# EAGLE schematic D-DAQ (EAGLE 6.4)
D-DAQ PIC32MX-controlled modular data aquisition and display
REVISION: 1
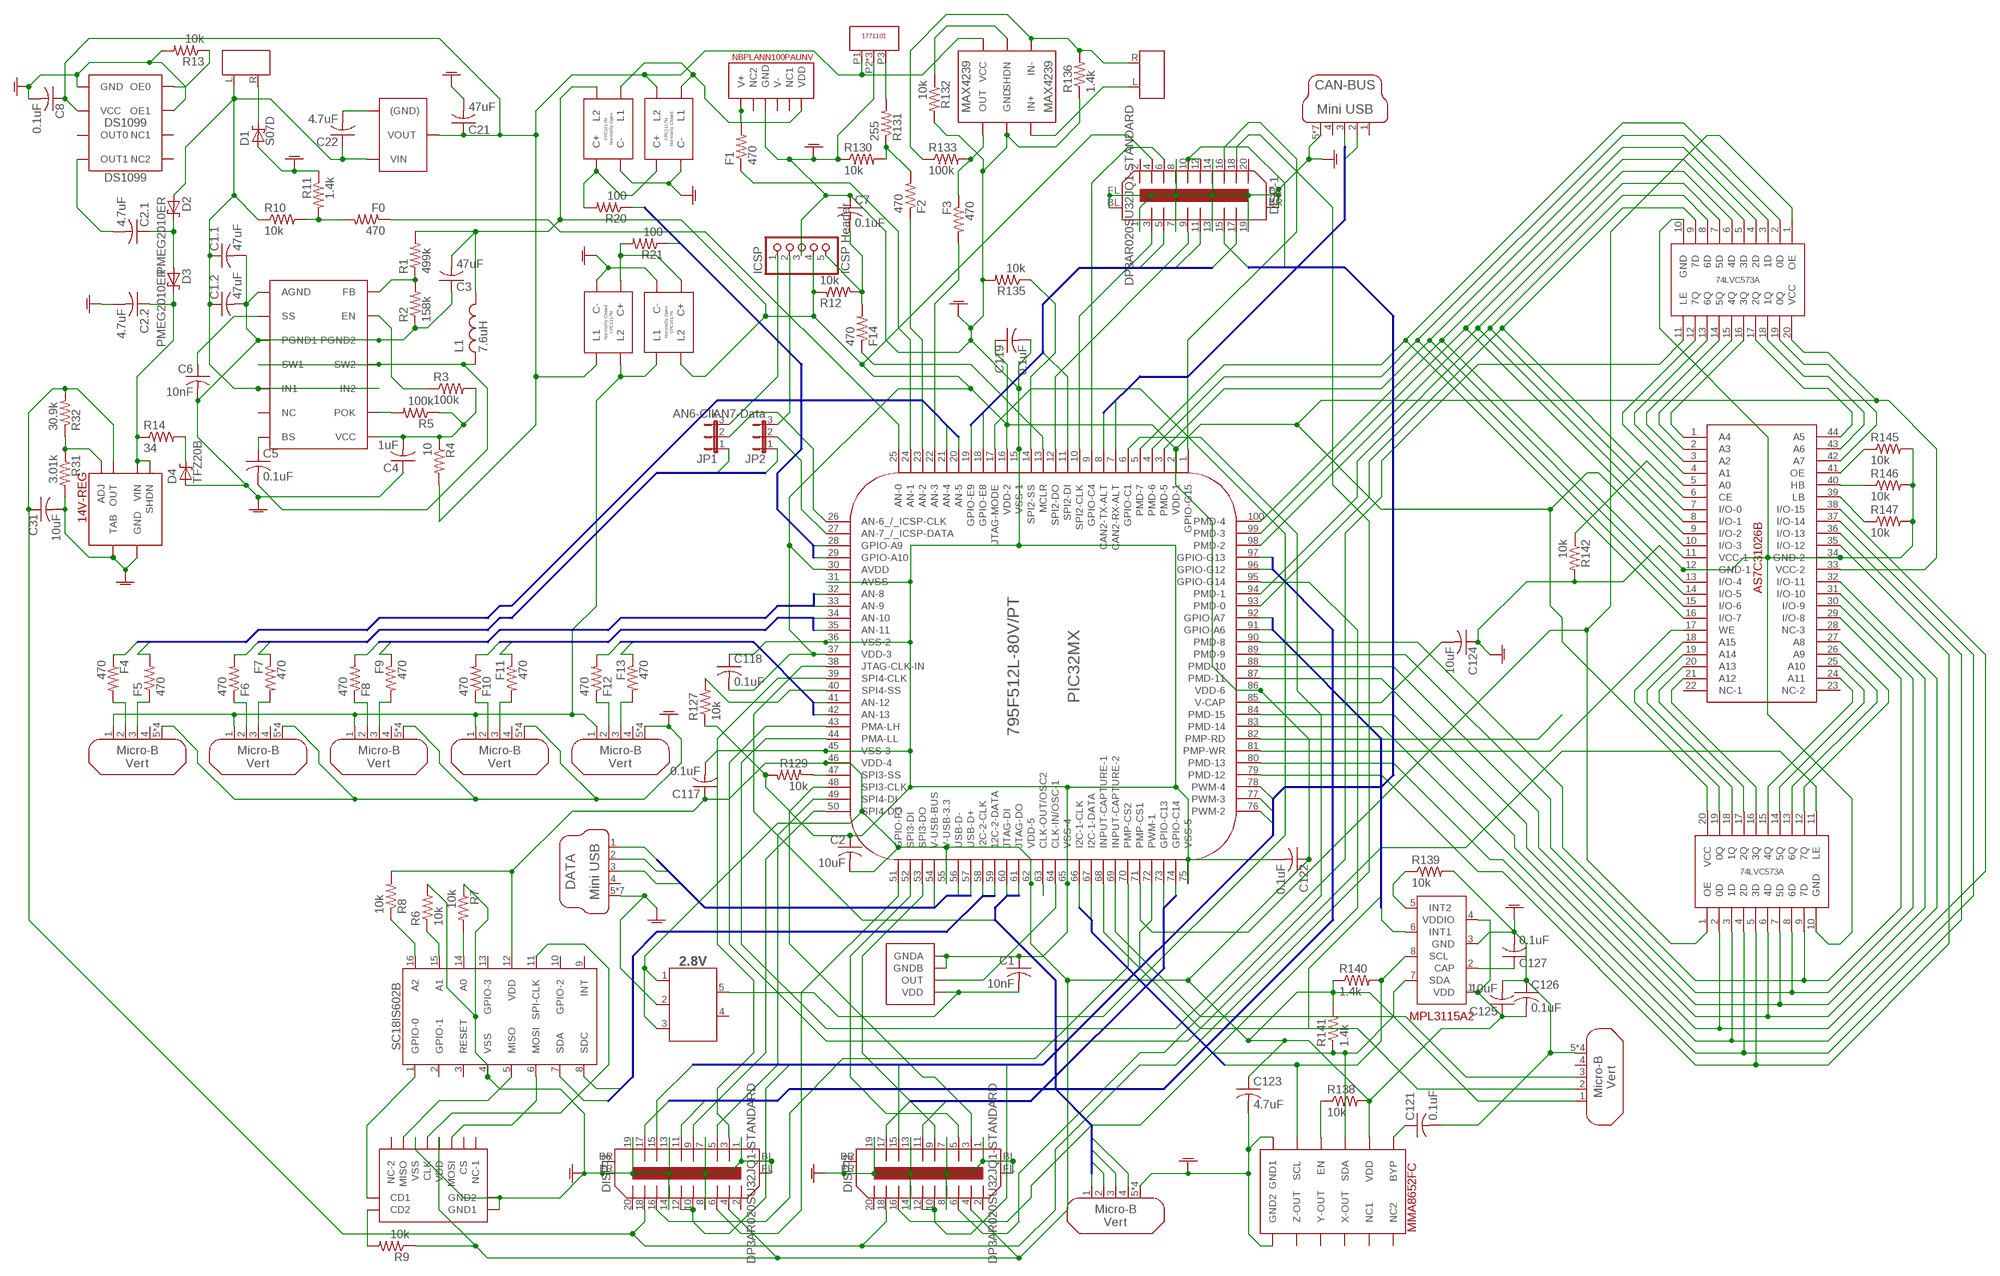
[diagram p0: schematic, sheet 1]

## Parts
2.8V  TC1016  [SOT-23-5]
3.3V-TOGGLE-1  NO SSR  CPC1017N  [SOP-4--CPC1017N]
3.3V-TOGGLE-2  NO SSR  CPC1017N  [SOP-4--CPC1017N]
4&5  Micro USB  105133-0001  [USB-MICRO-B-VERT]
5V-REG  ZLDO1117-5.0  ZLDO1117-ADJ  [SOT-223-5]
5V-TOGGLE-1  NC SSR  CPC1117N  [SOP-4--CPC1117N]
5V-TOGGLE-2  NC SSR  CPC1117N  [SOP-4--CPC1117N]
6&7  Micro USB  105133-0001  [USB-MICRO-B-VERT]
8&9  Micro USB  105133-0001  [USB-MICRO-B-VERT]
10&11  Micro USB  105133-0001  [USB-MICRO-B-VERT]
12&13  Micro USB  105133-0001  [USB-MICRO-B-VERT]
14V-REG  TL1963A-33DCQ  [SOT-223-6]
AS7C31026B  1 Mbit SRAM  AS7C31026B-12TC  [TSOP-44]
AUX-PRESS  PC-1771101  [PC-1771101]
C1  10nF  C-USC0603K  [C0603K]
C1.1  47uF  C-USC1206  [C1206]
C1.2  47uF  C-USC1206  [C1206]
C2  10uF  C-USC0603K  [C0603K]
C2.1  4.7uF  C-USC1206  [C1206]
C2.2  4.7uF  C-USC1206  [C1206]
C3  47uF  C-USC1206  [C1206]
C4  1uF  C-USC0603K  [C0603K]
C5  0.1uF  C-USC0603K  [C0603K]
C6  10nF  C-USC0603K  [C0603K]
C7  0.1uF  C-USC0603K  [C0603K]
C8  0.1uF  C-USC0603K  [C0603K]
C21  47uF  C-USC1206  [C1206]
C22  4.7uF  C-USC1206  [C1206]
C31  10uF  C-USC1206  [C1206]
C117  0.1uF  C-USC0603K  [C0603K]
C118  0.1uF  C-USC0603K  [C0603K]
C119  0.1uF  C-USC0603K  [C0603K]
C121  0.1uF  C-USC0603K  [C0603K]
C122  0.1uF  C-USC0603K  [C0603K]
C123  4.7uF  C-USC0603K  [C0603K]
C124  10uF  C-USC0603K  [C0603K]
C125  10uF  C-USC0603K  [C0603K]
C126  0.1uF  C-USC0603K  [C0603K]
C127  0.1uF  C-USC0603K  [C0603K]
CAN-BUS  Mini USB  UE25-BE55-10H  [USB-MINI-B-VERT]
D1  S07D  [SOD-123W]
D2  PMEG2010ER  S07D  [SOD-123W]
D3  PMEG2010ER  S07D  [SOD-123W]
D4  TFZ20B  TFZ-DIODE  [TUMD2]
DATA  Mini USB  UE25-BE55-10H  [USB-MINI-B-VERT]
DISP-1  DP3AR020SU32JQ1-STANDARD  [DP3AR020SU32JQ1-STANDARD]
DISP-2  DP3AR020SU32JQ1-STANDARD  [DP3AR020SU32JQ1-STANDARD]
DISP-3  DP3AR020SU32JQ1-STANDARD  [DP3AR020SU32JQ1-STANDARD]
EGT  1702610  [PC-1702610]
EGT-AMP  MAX4239  [SOT-8]
F0  470  R-US_R0603  [R0603]
F1  470  R-US_R0603  [R0603]
F2  470  R-US_R0603  [R0603]
F3  470  R-US_R0603  [R0603]
F4  470  R-US_R0603  [R0603]
F5  470  R-US_R0603  [R0603]
F6  470  R-US_R0603  [R0603]
F7  470  R-US_R0603  [R0603]
F8  470  R-US_R0603  [R0603]
F9  470  R-US_R0603  [R0603]
F10  470  R-US_R0603  [R0603]
F11  470  R-US_R0603  [R0603]
F12  470  R-US_R0603  [R0603]
F13  470  R-US_R0603  [R0603]
F14  470  R-US_R0603  [R0603]
ICSP  ICSP Header  PINHD-1X5  [1X05]
IMP.  Micro USB  105133-0001  [USB-MICRO-B-VERT]
JP1  AN6-Clk  JP2E  [JP2]
JP2  AN7-Data  JP2E  [JP2]
JTAG  Micro USB  105133-0001  [USB-MICRO-B-VERT]
L1  7.6uH  WE-INDUCTOR  [7443551XXX]
LATCH-HIGH  Octal D-Latch  74LVC573A  [TSSOP-20]
LATCH-LOW  Octal D-Latch  74LVC573A  [TSSOP-20]
MAIN-SMPS  MP2209  [QFN-14]
MICRO-SD  SCHA4B0400  MICRO-SD-SLOT  [SCHA4B0400]
MMA8652FC  Accelerometer  MMA8491Q  [QFN-12]
MPL3115A101  Baro & Temp  MPL3115A2  [LGA-8]
NBPLANN100PAUNV  Boost  NBP-SENSORS  [LEADLESS-SMT]
PIC32MX  795F512L-80V/PT  PIC32MX795F512L-80I/PT  [TQFP-100]
POWER  1702610  [PC-1702610]
R1  499k  R-US_R0603  [R0603]
R2  158k  R-US_R0603  [R0603]
R3  100k  R-US_R0603  [R0603]
R4  10  R-US_R0603  [R0603]
R5  100k  R-US_R0603  [R0603]
R6  10k  R-US_R0603  [R0603]
R7  10k  R-US_R0603  [R0603]
R8  10k  R-US_R0603  [R0603]
R9  10k  R-US_R0603  [R0603]
R10  10k  R-US_R0603  [R0603]
R11  1.4k  R-US_R0603  [R0603]
R12  10k  R-US_R0603  [R0603]
R13  10k  R-US_R0603  [R0603]
R14  34  R-US_R0603  [R0603]
R20  100  R-US_R0603  [R0603]
R21  100  R-US_R0603  [R0603]
R31  3.01k  R-US_R0603  [R0603]
R32  30.9k  R-US_R0603  [R0603]
R127  10k  R-US_R0603  [R0603]
R129  10k  R-US_R0603  [R0603]
R130  10k  R-US_R0603  [R0603]
R131  255  R-US_R0603  [R0603]
R132  10k  R-US_R0603  [R0603]
R133  100k  R-US_R0603  [R0603]
R135  10k  R-US_R0603  [R0603]
R136  1.4k  R-US_R0603  [R0603]
R138  10k  R-US_R0603  [R0603]
R139  10k  R-US_R0603  [R0603]
R140  1.4k  R-US_R0603  [R0603]
R141  1.4k  R-US_R0603  [R0603]
R142  10k  R-US_R0603  [R0603]
R145  10k  R-US_R0603  [R0603]
R146  10k  R-US_R0603  [R0603]
R147  10k  R-US_R0603  [R0603]
SC18IS602B  I2C to SPI  SC18IS602B  [TSSOP-16]
Y1  16.368 MHz  XTC7009  [XTC7009]
Y2  DS1099  [SOIC-8]

## Nets
3.3-&-5V-TOGGLE1: PIC32MX.28(GPIO-A9) R21.1
3.3-&-5V-TOGGLE2: PIC32MX.29(GPIO-A10) R20.1
3.3V-RAIL: 2.8V.1(V-IN) 2.8V.3(SHDN) 3.3V-TOGGLE-1.4(L2) 3.3V-TOGGLE-2.4(L2) AS7C31026B.11(VCC-1) AS7C31026B.33(VCC-2) C2.2 C3.2 C117.1 C118.2 C119.1 C122.1 C123.1 C125.1 C126.2 DISP-1.4 DISP-2.4 DISP-3.4 ICSP.4 IMP..1 L1.P$2 LATCH-HIGH.20(VCC) LATCH-LOW.20(VCC) MICRO-SD.4(VDD) MMA8652FC.2(VDD) MPL3115A101.1(VDD) MPL3115A101.4(VDDIO) PIC32MX.2(VDD-1) PIC32MX.16(VDD-2) PIC32MX.30(AVDD) PIC32MX.37(VDD-3) PIC32MX.46(VDD-4) PIC32MX.55(V-USB-3.3) PIC32MX.62(VDD-5) PIC32MX.86(VDD-6) R1.2 R8.2 R9.1 R12.1 R138.2 R140.1 R141.2 SC18IS602B.12(VDD)
5V-ADJ: 5V-REG.ADJ((GND)) C22.2
5V-RAIL: 5V-REG.VOUT 5V-REG.VOUT-1(VOUT) 5V-TOGGLE-1.3(L1) 5V-TOGGLE-2.4(L2) AUX-PRESS.P1 C8.1 C21.1 EGT-AMP.6(VCC) R4.2 Y2.3(VCC)
12V-BS: C5.1 MAIN-SMPS.7(BS)
12V-ENABLE: MAIN-SMPS.13(EN) R3.1
12V-FB: MAIN-SMPS.P14(FB) R1.1 R2.2
12V-INPUT: 5V-REG.VIN C1.1.1 C1.2.1 C22.1 D2.P$2 MAIN-SMPS.5(IN1) MAIN-SMPS.10(IN2) POWER.L R10.1
12V-OK: MAIN-SMPS.9(POK) R5.2
12V-SS: C6.1 MAIN-SMPS.2(SS)
12V-SW: C5.2 L1.P$1 MAIN-SMPS.4(SW1) MAIN-SMPS.11(SW2)
12V-VCC: C4.2 MAIN-SMPS.8(VCC) R3.2 R4.1 R5.1
14V-12V-DIVIDER: F0.2 R10.2 R11.2
14V-ADJ: 14V-REG.ADJ R31.1 R32.1
14V-INPUT: 14V-REG.SHDN 14V-REG.VIN C2.2.1 D3.P$1 R14.1
14V-RAIL: 14V-REG.VOUT(OUT) C31.1 DISP-1.18 DISP-2.18 DISP-3.18 R32.2
100-PSI-SENSOR-RES: 3.3V-TOGGLE-2.1(C+) 5V-TOGGLE-2.1(C+) R20.2
A0-PD: R7.2 SC18IS602B.14(A0)
A1-PD: R6.1 SC18IS602B.15(A1)
A2-PU: R8.1 SC18IS602B.16(A2)
ACCEL-EN: MMA8652FC.4(EN) R138.1
ADD-0: AS7C31026B.5(A0) LATCH-LOW.12(7Q)
ADD-1: AS7C31026B.4(A1) LATCH-LOW.13(6Q)
ADD-2: AS7C31026B.3(A2) LATCH-LOW.14(5Q)
ADD-3: AS7C31026B.2(A3) LATCH-LOW.15(4Q)
ADD-4: AS7C31026B.1(A4) LATCH-LOW.16(3Q)
ADD-5: AS7C31026B.44(A5) LATCH-LOW.17(2Q)
ADD-6: AS7C31026B.43(A6) LATCH-LOW.18(1Q)
ADD-7: AS7C31026B.42(A7) LATCH-LOW.19(0Q)
ADD-8: AS7C31026B.27(A8) LATCH-HIGH.12(7Q)
ADD-9: AS7C31026B.26(A9) LATCH-HIGH.13(6Q)
ADD-10: AS7C31026B.25(A10) LATCH-HIGH.14(5Q)
ADD-11: AS7C31026B.24(A11) LATCH-HIGH.15(4Q)
ADD-12: AS7C31026B.21(A12) LATCH-HIGH.16(3Q)
ADD-13: AS7C31026B.20(A13) LATCH-HIGH.17(2Q)
ADD-14: AS7C31026B.19(A14) LATCH-HIGH.18(1Q)
ADD-15: AS7C31026B.18(A15) LATCH-HIGH.19(0Q)
AN0-VOLT: F0.1 PIC32MX.25(AN-0)
AN1-BOOST: F1.1 PIC32MX.24(AN-1)
AN2-OIL-PESS: F2.1 PIC32MX.23(AN-2)
AN3-EGT: F3.2 PIC32MX.22(AN-3)
AN4: 4&5.2 F4.2
AN5: 4&5.3 F5.1
AN6: 6&7.2 F6.1
AN7: 6&7.3 F7.2
AN8: 8&9.2 F8.1
AN9: 8&9.3 F9.2
AN10: 10&11.2 F10.1
AN11: 10&11.3 F11.2
AN12: 12&13.2 F12.1
AN13: 12&13.3 F13.2
AUTO-DETECT: 3.3V-TOGGLE-1.1(C+) 5V-TOGGLE-1.1(C+) R21.2
AUX-OUT: F2.2 R130.2 R131.1
BARO-INT2: MPL3115A101.5(INT2) R139.1
BOOST-OUT: F1.2 NBPLANN100PAUNV.6(V+)
BOOST-PWR: 3.3V-TOGGLE-2.3(L1) 5V-TOGGLE-2.3(L1) NBPLANN100PAUNV.1(VDD)
CAN-BUS1: CAN-BUS.2 PIC32MX.8(CAN2-TX-ALT)
CAN-BUS2: CAN-BUS.3 PIC32MX.7(CAN2-RX-ALT)
CARD-DETECT: MICRO-SD.G3(CD1) SC18IS602B.1(GPIO-0)
CE: AS7C31026B.6(CE) R142.1
CHARG-CAPS: C2.1.2 Y2.1(OUT1)
CP-PUMP: C2.1.1 D2.P$1 D3.P$2
CPS-INPUT: IMP..2 PIC32MX.68(INPUT-CAPTURE-1)
CRYSTAL-OUT: PIC32MX.63(CLK-OUT/OSC2)
DISP1-B1: DISP-1.5 PIC32MX.11(SPI2-DI)
DISP1-B2: DISP-1.11 PIC32MX.18(GPIO-E8)
DISP1-B3: DISP-1.17 PIC32MX.19(GPIO-E9)
DISP2-B1: DISP-2.5 PIC32MX.52(SPI3-DI)
DISP2-B2: DISP-2.11 PIC32MX.73(GPIO-C13)
DISP2-B3: DISP-2.17 PIC32MX.74(GPIO-C14)
DISP2-RS: DISP-2.16 PIC32MX.95(GPIO-G14)
DISP3-B1: DISP-3.5 PIC32MX.49(SPI4-DI)
DISP3-B2: DISP-3.11 PIC32MX.96(GPIO-G12)
DISP3-B3: DISP-3.17 PIC32MX.97(GPIO-G13)
DISP3-RS: DISP-1.16 PIC32MX.1(GPIO-G15)
DISP-1_HPD: DISP-1.6 PIC32MX.9(GPIO-C4)
DISP-HPD2: DISP-2.6 PIC32MX.6(GPIO-C1)
DISP-HPD3: DISP-3.6 PIC32MX.51(GPIO-F3)
EGT-NEG-IN: EGT-AMP.4(IN-) EGT.R R133.1 R136.2
EGT-OUT: EGT-AMP.1(OUT) F3.1 R133.2
EGT-POS-IN: EGT-AMP.3(IN+) EGT.L
EGT-SHTDWN: EGT-AMP.5(SHDN) R132.1
GND: 2.8V.2(GND) 3.3V-TOGGLE-1.2(C-) 3.3V-TOGGLE-2.2(C-) 4&5.5 4&5.T0 4&5.T1 4&5.T2 5V-TOGGLE-1.2(C-) 5V-TOGGLE-2.2(C-) 6&7.5 6&7.T0 6&7.T1 6&7.T2 8&9.5 8&9.T0 8&9.T1 8&9.T2 10&11.5 10&11.T0 10&11.T1 10&11.T2 12&13.5 12&13.T0 12&13.T1 12&13.T2 14V-REG.GND 14V-REG.TAB AS7C31026B.12(GND-1) AS7C31026B.34(GND-2) AUX-PRESS.P2 AUX-PRESS.T0 AUX-PRESS.T1 C1.1 C1.1.2 C1.2.2 C2.1 C2.2.2 C3.1 C4.1 C6.2 C7.1 C8.2 C21.2 C31.2 C117.2 C118.1 C119.2 C121.2 C122.2 C123.2 C124.1 C125.2 C126.1 C127.2 CAN-BUS.5 CAN-BUS.P$1 CAN-BUS.P$2 CAN-BUS.P$3 CAN-BUS.P$4 CAN-BUS.T0 CAN-BUS.T1 D1.P$2 D4.P$1(A) DATA.5 DATA.P$1 DATA.P$2 DATA.P$3 DATA.P$4 DATA.T0 DATA.T1 DISP-1.1 DISP-1.7 DISP-1.8 DISP-1.13 DISP-1.14 DISP-1.19 DISP-1.BL DISP-1.BR DISP-1.FL DISP-1.FR DISP-2.1 DISP-2.7 DISP-2.8 DISP-2.13 DISP-2.14 DISP-2.19 DISP-2.BL DISP-2.BR DISP-2.FL DISP-2.FR DISP-3.1 DISP-3.7 DISP-3.8 DISP-3.13 DISP-3.14 DISP-3.19 DISP-3.BL DISP-3.BR DISP-3.FL DISP-3.FR EGT-AMP.2(GND) ICSP.3 IMP..5 IMP..T0 IMP..T1 IMP..T2 JTAG.5 JTAG.T0 JTAG.T1 JTAG.T2 LATCH-HIGH.10(GND) LATCH-LOW.10(GND) MAIN-SMPS.1(AGND) MAIN-SMPS.3(PGND1) MAIN-SMPS.12(PGND2) MAIN-SMPS.P$15(AGND) MICRO-SD.6(VSS) MICRO-SD.G1(GND1) MICRO-SD.G2(GND2) MMA8652FC.6(GND1) MMA8652FC.7(GND2) MPL3115A101.3(GND) NBPLANN100PAUNV.4(GND) PIC32MX.15(VSS-1) PIC32MX.31(AVSS) PIC32MX.36(VSS-2) PIC32MX.45(VSS-3) PIC32MX.65(VSS-4) PIC32MX.75(VSS-5) R2.1 R6.2 R7.1 R11.1 R13.2 R31.2 R127.1 R129.2 R130.1 R132.2 R135.2 R136.1 R139.2 R142.2 R145.2 R146.2 R147.2 SC18IS602B.4(VSS) Y1.P$1(GNDA) Y1.P$2(GNDB) Y2.4(GND) Y2.6(OE1)
HB: AS7C31026B.40(HB) R146.1
I2C-INT-BUS-PIN1: MPL3115A101.6(INT1) PIC32MX.91(GPIO-A6)
I2C-INT-BUS-PIN2: PIC32MX.92(GPIO-A7)
I2C-PIN1: MMA8652FC.5(SCL) MPL3115A101.8(SCL) PIC32MX.66(I2C-1-CLK) R140.2
I2C-PIN2: MMA8652FC.3(SDA) MPL3115A101.7(SDA) PIC32MX.67(I2C-1-DATA) R141.1
I2C-SD-PIN1: PIC32MX.58(I2C-2-CLK) SC18IS602B.8(SDC)
I2C-SD-PIN2: PIC32MX.59(12C-2-DATA) SC18IS602B.7(SDA)
ICSP-CLK: ICSP.1 JP1.3
ICSP-DATA: ICSP.2 JP2.3
ICSP-MCLR: C7.2 F14.2 ICSP.5 R12.2
INPUT-6_/_ICSP-CLK: JP1.2 PIC32MX.26(AN-6_/_ICSP-CLK)
INPUT-7_/_ICSP-DATA: JP2.2 PIC32MX.27(AN-7_/_ICSP-DATA)
JTAG-PIN-1: JTAG.1 PIC32MX.17(JTAG-MODE)
JTAG-PIN-2: JTAG.2 PIC32MX.38(JTAG-CLK-IN)
JTAG-PIN-3: JTAG.3 PIC32MX.60(JTAG-DI)
JTAG-PIN-4: JTAG.4 PIC32MX.61(JTAG-DO)
LB: AS7C31026B.39(LB) R147.1
LNS-INPUT: IMP..3 PIC32MX.69(INPUT-CAPTURE-2)
MCLR: F14.1 PIC32MX.13(MCLR)
MPL-BYP-CAP: C127.1 MPL3115A101.2(CAP)
N$5: C121.1 MMA8652FC.1(BYP)
OE: AS7C31026B.41(OE) R145.1
OE0: R13.1 Y2.5(OE0)
OIL-PRESS-OUT: AUX-PRESS.P3 R131.2
OSC-PWR: 2.8V.5(V-OUT) C1.2 Y1.P$4(VDD)
OSC-SIG: PIC32MX.64(CLK-IN/OSC-1) Y1.P$3(OUT)
PMA-CS2: DISP-3.16 PIC32MX.70(PMP-CS2)
PMA-HL: LATCH-HIGH.11(LE) PIC32MX.43(PMA-LH)
PMA-LL: LATCH-LOW.11(LE) PIC32MX.44(PMA-LL)
PMD0: AS7C31026B.7(I/O-0) LATCH-LOW.9(7D) PIC32MX.93(PMD-0)
PMD1: AS7C31026B.8(I/O-1) LATCH-LOW.8(6D) PIC32MX.94(PMD-1)
PMD2: AS7C31026B.9(I/O-2) LATCH-LOW.7(5D) PIC32MX.98(PMD-2)
PMD3: AS7C31026B.10(I/O-3) LATCH-LOW.6(4D) PIC32MX.99(PMD-3)
PMD4: AS7C31026B.13(I/O-4) LATCH-LOW.5(3D) PIC32MX.100(PMD-4)
PMD5: AS7C31026B.14(I/O-5) LATCH-LOW.4(2D) PIC32MX.3(PMD-5)
PMD6: AS7C31026B.15(I/O-6) LATCH-LOW.3(1D) PIC32MX.4(PMD-6)
PMD7: AS7C31026B.16(I/O-7) LATCH-LOW.2(0D) PIC32MX.5(PMD-7)
PMD8: AS7C31026B.29(I/O-8) LATCH-HIGH.9(7D) PIC32MX.90(PMD-8)
PMD9: AS7C31026B.30(I/O-9) LATCH-HIGH.8(6D) PIC32MX.89(PMD-9)
PMD10: AS7C31026B.31(I/O-10) LATCH-HIGH.7(5D) PIC32MX.88(PMD-10)
PMD11: AS7C31026B.32(I/O-11) LATCH-HIGH.6(4D) PIC32MX.87(PMD-11)
PMD12: AS7C31026B.35(I/O-12) LATCH-HIGH.5(3D) PIC32MX.79(PMD-12)
PMD13: AS7C31026B.36(I/O-13) LATCH-HIGH.4(2D) PIC32MX.80(PMD-13)
PMD15: AS7C31026B.38(I/O-15) LATCH-HIGH.2(0D) PIC32MX.84(PMD-15)
PMD-14: AS7C31026B.37(I/O-14) LATCH-HIGH.3(1D) PIC32MX.83(PMD-14)
PMD-READ: PIC32MX.82(PMP-RD)
PMP-CS1: LATCH-HIGH.1(OE) LATCH-LOW.1(OE) PIC32MX.71(PMP-CS1)
PMP-WRITE: AS7C31026B.17(WE) PIC32MX.81(PMP-WR)
PWM1: DISP-3.15 PIC32MX.72(PWM-1)
PWM2: DISP-2.15 PIC32MX.76(PWM-2)
PWM3: DISP-1.15 PIC32MX.77(PWM-3)
PWM4: DISP-1.10 DISP-1.12 DISP-2.10 DISP-2.12 DISP-3.10 DISP-3.12 PIC32MX.78(PWM-4)
PWR-GND: D1.P$1 POWER.R
SD-MISO: MICRO-SD.7(MISO) SC18IS602B.5(MISO)
SD-MOSI: MICRO-SD.3(MOSI) SC18IS602B.6(MOSI)
SD-PULL-DOWN: MICRO-SD.G4(CD2) R9.2
SD-SPI-CLK: MICRO-SD.5(CLK) SC18IS602B.11(SPI-CLK)
SENSOR_PAIR_AN4: F4.1 PIC32MX.21(AN-4)
SENSOR_PAIR_AN5: F5.2 PIC32MX.20(AN-5)
SENSOR_PAIR_AN6: F6.2 JP1.1
SENSOR_PAIR_AN7: F7.1 JP2.1
SENSOR_PAIR_AN8: F8.2 PIC32MX.32(AN-8)
SENSOR_PAIR_AN9: F9.1 PIC32MX.33(AN-9)
SENSOR_PAIR_AN10: F10.2 PIC32MX.34(AN-10)
SENSOR_PAIR_AN11: F11.1 PIC32MX.35(AN-11)
SENSOR_PAIR_AN12: F12.2 PIC32MX.41(AN-12)
SENSOR_PAIR_AN13: F13.1 PIC32MX.42(AN-13)
SHUNT: D4.P$2(C) R14.2
SPI2-CLK: DISP-1.3 PIC32MX.10(SPI2-CLK)
SPI2-DATA: DISP-1.9 PIC32MX.12(SPI2-DO)
SPI2-SS: PIC32MX.14(SPI2-SS) R135.1
SPI3-CLK: DISP-2.3 PIC32MX.48(SPI3-CLK)
SPI3-DATA: DISP-2.9 PIC32MX.53(SPI3-DO)
SPI3-SS: PIC32MX.47(SPI3-SS) R129.1
SPI4-CLK: DISP-3.3 PIC32MX.39(SPI4-CLK)
SPI4-DATA: DISP-3.9 PIC32MX.50(SPI4-DO)
SPI4-SS: PIC32MX.40(SPI4-SS) R127.2
USB-PIN1: DATA.1 PIC32MX.54(V-USB-BUS)
USB-PIN2: DATA.2 PIC32MX.56(USB-D-)
USB-PIN3: DATA.3 PIC32MX.57(USB-D+)
USB-PWR: 3.3V-TOGGLE-1.3(L1) 4&5.1 5V-TOGGLE-1.4(L2) 6&7.1 8&9.1 10&11.1 12&13.1
V-CAP: C124.2 PIC32MX.85(V-CAP)
Unconnected: 2.8V.4(NC) 4&5.4 6&7.4 8&9.4 10&11.4 12&13.4 AS7C31026B.22(NC-1) AS7C31026B.23(NC-2) AS7C31026B.28(NC-3) CAN-BUS.4 DATA.4 DISP-1.2 DISP-1.20 DISP-2.2 DISP-2.20 DISP-3.2 DISP-3.20 IMP..4 MAIN-SMPS.6(NC) MICRO-SD.1(NC-1) MICRO-SD.2(CS) MICRO-SD.8(NC-2) MMA8652FC.8(Z-OUT) MMA8652FC.9(Y-OUT) MMA8652FC.10(X-OUT) MMA8652FC.11(NC1) MMA8652FC.12(NC2) NBPLANN100PAUNV.2(NC1) NBPLANN100PAUNV.3(V-) NBPLANN100PAUNV.5(NC2) SC18IS602B.2(GPIO-1) SC18IS602B.3(RESET) SC18IS602B.9(INT) SC18IS602B.10(GPIO-2) SC18IS602B.13(GPIO-3) Y2.2(OUT0) Y2.7(NC1) Y2.8(NC2)

## Buses
SENSOR_PAIR_AN[8..9]
SENSOR_PAIR_AN[10..11]
SENSOR_PAIR_AN[12..13]
PWM[1..4]
SENSOR_PAIR_AN[4..5]
DISP2-B[2..3]
I2C-SD-PIN[1..2]
SENSOR_PAIR_AN[6..7]
I2C-PIN[1..2]
DISP1-B[1..3]
USB-PIN[1..3]
CAN-BUS[1..2]
JTAG-PIN-[1..4]
3.3-&-5V-TOGGLE[1..2]
I2C-INT-BUS-PIN[1..2]
DISP3-B[2..3]

## Power pins joined to a net without a drawn wire
P$1: CAN-BUS.1

## Library data of the parts
2.8V = Parts for DC MF Gauge:TC1016: 2.8V LDO
3.3V-TOGGLE-1 3.3V-TOGGLE-2 = Parts for DC MF Gauge:CPC1017N: SS Relay, NO, SPST
4&5 6&7 8&9 10&11 12&13 IMP. JTAG = Parts for DC MF Gauge:105133-0001: Molex Micro-B receptical, perpendicular to board
5V-REG = Parts for DC MF Gauge:ZLDO1117-ADJ: Adjustable LDO
5V-TOGGLE-1 5V-TOGGLE-2 = Parts for DC MF Gauge:CPC1117N: SS Relay, NC, SPST
14V-REG = Parts for DC MF Gauge:TL1963A-33DCQ
AS7C31026B = Parts for DC MF Gauge:AS7C31026B-12TC: 1-Mbit, 12 ns, 16-bit wide SRAM; ACCESS_TIME: 12 ns
AUX-PRESS = con-molex-alt:PC-1771101
C1 C1.1 C1.2 C2 C2.1 C2.2 C3-C8 C21 C22 C31 C117-C119 C121-C127 = resistor:C-US: CAPACITOR, American symbol
CAN-BUS DATA = Parts for DC MF Gauge:UE25-BE55-10H: Vertical Mini USB Type-B
D1-D3 = Parts for D-DAQ:S07D: 100V, 0.7A continuous diode
D4 = Parts for D-DAQ:TFZ-DIODE
DISP-1-DISP-3 = con-molex-alt:DP3AR020SU32JQ1-STANDARD
EGT POWER = Parts for DC MF Gauge:1702610: Press Fit Phoenix Connect 2-wire Terminal Block
EGT-AMP = Parts for DC MF Gauge:MAX4239: High Precision & Accuracy OP Amp
F0 F1-F14 R1-R14 R20 R21 R31 R32 R127 R129-R133 R135 R136 R138-R142 R145-R147 = resistor:R-US_: RESISTOR, American symbol
ICSP = pinhead:PINHD-1X5: PIN HEADER
JP1 JP2 = jumper:JP2E: JUMPER
L1 = Parts for DC MF Gauge:WE-INDUCTOR
LATCH-HIGH LATCH-LOW = Parts for DC MF Gauge:74LVC573A: 74LVC573A, 8.5 ns @ 3.3 V Octal Transparent D-type latch
MAIN-SMPS = Parts for DC MF Gauge:MP2209: 2A Buck SMPS Regulator
MICRO-SD = Parts for DC MF Gauge:MICRO-SD-SLOT
MMA8652FC = Parts for DC MF Gauge:MMA8491Q: Digital Accelerometer: 3-axis, 12-bit
MPL3115A101 = Parts for DC MF Gauge:MPL3115A2: I2C Barometric Pressure & Ambient Temperature sensor
NBPLANN100PAUNV = Parts for DC MF Gauge:NBP-SENSORS: Boost Pressure sensor
PIC32MX = Parts for DC MF Gauge:PIC32MX795F512L-80I/PT: PIC32MX795 Microcontroller
SC18IS602B = Parts for DC MF Gauge:SC18IS602B: I2C-to-SPI Protocol Converter: Used for independant SPI bus for SD Card
Y1 = Parts for DC MF Gauge:XTC7009: 16.368 MEMS Oscillator 0.2 ppm, -30˚C to 85˚C
Y2 = Parts for DC MF Gauge:DS1099

## Net classes
0 min: width 0.152 mm, drill 0.33 mm, clearance 0.152 mm
1 default: width 0.178 mm, drill 0.381 mm, clearance 0.178 mm
2 prefered: width 0.203 mm, drill 0.381 mm, clearance 0.203 mm
3 power-low: width 0.406 mm, drill 0.381 mm, clearance 0.254 mm
4 power-med: width 0.61 mm, drill 0.508 mm, clearance 0.381 mm
5 power-hi: width 0.813 mm, drill 0.635 mm, clearance 0.508 mm